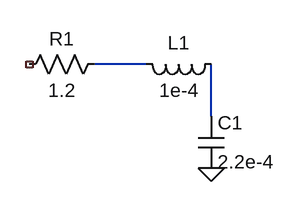
[diagram p0: schematic RLC_low_pass.asc]
RLC_low_pass.asc, the LTspice schematic file:
Version 4
SHEET 1 880 680
WIRE 144 112 80 112
WIRE 224 176 224 112
FLAG 224 240 0
SYMBOL res 96 96 R90
WINDOW 0 0 56 VBottom 2
WINDOW 3 32 56 VTop 2
SYMATTR InstName R1
SYMATTR Value 1.2
SYMBOL ind 240 96 R90
WINDOW 0 5 56 VBottom 2
WINDOW 3 32 56 VTop 2
SYMATTR InstName L1
SYMATTR Value 1e-4
SYMBOL cap 208 176 R0
SYMATTR InstName C1
SYMATTR Value 2.2e-4

The netlist it stands for:
* RLC_low_pass.asc
R1 N001 NC_01 1.2
L1 N002 N001 1e-4
C1 N002 0 2.2e-4
.backanno
.end